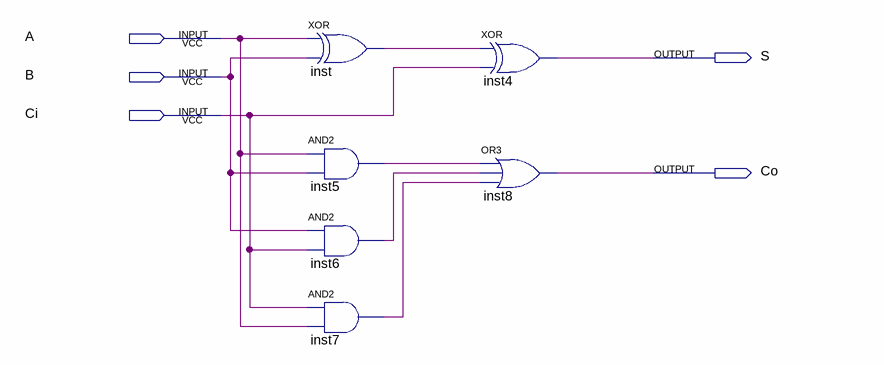
[diagram p0: schematic sheet]
// Quartus schematic fulladder.bdf as structural Verilog: 6 symbols, 5 pins
module fulladder (
  input  A,
  input  B,
  input  Ci,
  output S,
  output Co
);

  wire inst5_out, inst6_out, inst7_out, inst_out;

  xor inst (inst_out, A, B);
  and inst5 (inst5_out, A, B);
  and inst6 (inst6_out, B, Ci);
  and inst7 (inst7_out, Ci, A);
  xor inst4 (S, inst_out, Ci);
  or inst8 (Co, inst5_out, inst6_out, inst7_out);
endmodule
